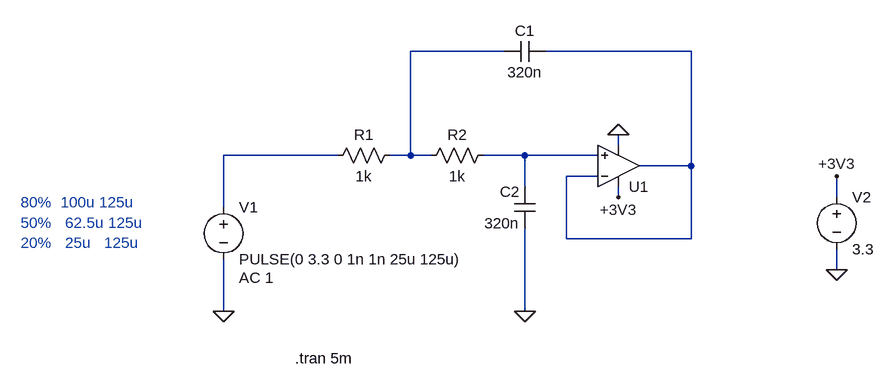
[diagram p0: schematic alert_filter.asc]
alert_filter.asc, the LTspice schematic file:
Version 4
SHEET 1 1172 680
WIRE 336 -208 192 -208
WIRE 624 -208 400 -208
WIRE 512 -64 512 -80
WIRE 80 -48 -96 -48
WIRE 192 -48 192 -208
WIRE 192 -48 160 -48
WIRE 224 -48 192 -48
WIRE 368 -48 304 -48
WIRE 480 -48 368 -48
WIRE 624 -32 624 -208
WIRE 624 -32 544 -32
WIRE 480 -16 432 -16
WIRE 368 0 368 -48
WIRE 512 16 512 0
WIRE 848 16 848 -16
WIRE -96 32 -96 -48
WIRE 432 80 432 -16
WIRE 624 80 624 -32
WIRE 624 80 432 80
WIRE 848 128 848 96
WIRE -96 192 -96 112
WIRE 368 192 368 64
FLAG -96 192 0
FLAG 848 128 0
FLAG 848 -16 +3V3
FLAG 368 192 0
FLAG 512 -80 0
FLAG 512 16 +3V3
SYMBOL voltage -96 16 R0
WINDOW 123 24 124 Left 2
WINDOW 39 0 0 Left 0
SYMATTR InstName V1
SYMATTR Value PULSE(0 3.3 0 1n 1n 25u 125u)
SYMATTR Value2 AC 1
SYMBOL voltage 848 0 R0
WINDOW 123 0 0 Left 0
WINDOW 39 0 0 Left 0
SYMATTR InstName V2
SYMATTR Value 3.3
SYMBOL res 176 -64 R90
WINDOW 0 0 56 VBottom 2
WINDOW 3 32 56 VTop 2
SYMATTR InstName R1
SYMATTR Value 1k
SYMBOL res 320 -64 R90
WINDOW 0 0 56 VBottom 2
WINDOW 3 32 56 VTop 2
SYMATTR InstName R2
SYMATTR Value 1k
SYMBOL cap 400 -224 R90
WINDOW 0 0 32 VBottom 2
WINDOW 3 32 32 VTop 2
SYMATTR InstName C1
SYMATTR Value 320n
SYMBOL cap 384 64 R180
WINDOW 0 24 56 Left 2
WINDOW 3 24 8 Left 2
SYMATTR InstName C2
SYMATTR Value 320n
SYMBOL OpAmps\\UniversalOpAmp 512 -32 M180
SYMATTR InstName U1
TEXT 14 264 Left 2 !.tran 5m
TEXT -408 24 Left 2 ;80%  100u 125u\n50%   62.5u 125u\n20%   25u   125u

The netlist it stands for:
* alert_filter.asc
V1 N003 0 PULSE(0 3.3 0 1n 1n 25u 125u) AC 1
V2 +3V3 0 3.3
R1 N001 N003 1k
R2 N004 N001 1k
C1 N002 N001 320n
C2 0 N004 320n
XU1 N004 N002 +3V3 0 N002 level1 Avol=1Meg GBW=10Meg Vos=0 En=0 Enk=0 In=0 Ink=0 Rin=500Meg  ; pins In+ In- V+ V- OUT
.tran 5m
* 80%  100u 125u
* 50%   62.5u 125u
* 20%   25u   125u
.lib UniversalOpAmp1.lib
.backanno
.end